# Altium schematic sheet SunS_Panels_Interfaces.SchDoc: Panel connectors
size A4; Author: Michał Gumiela
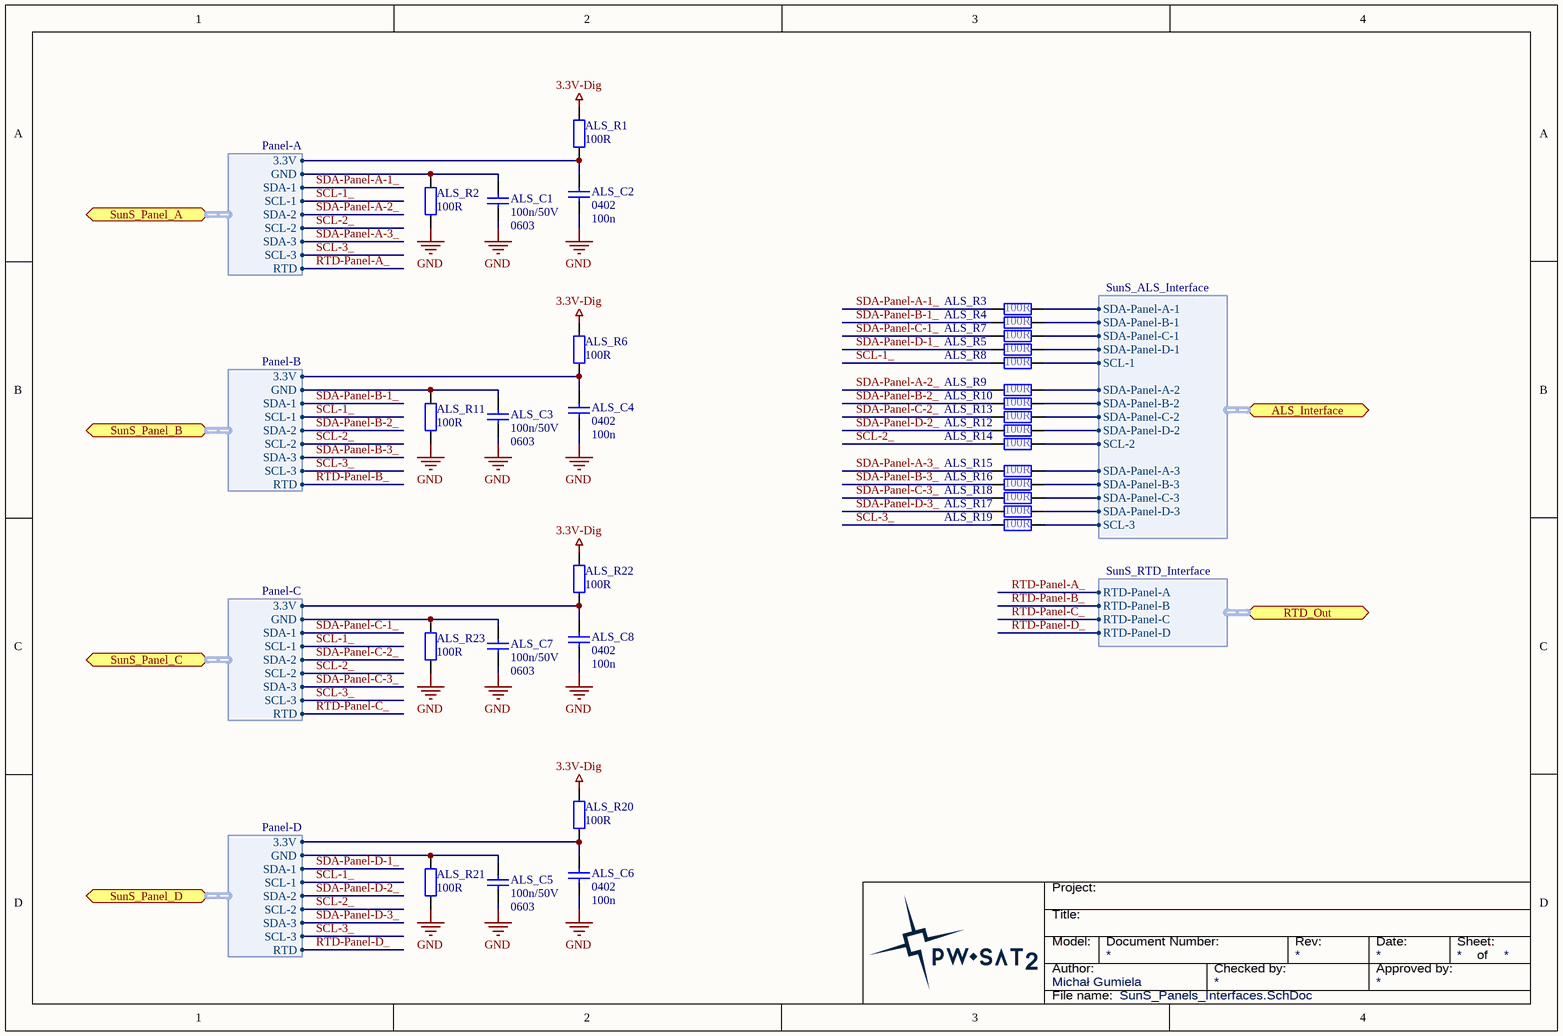
[diagram p0: SunS_Panels_Interfaces.SchDoc]

## Parts
ALS_C1  value 100n/50V  Package: 0603  [SMD_Capacitor_0603]  (hidden comment: Cap)
ALS_C2  0402  value 100n  [SMD_Capacitor_0402]
ALS_C3  value 100n/50V  Package: 0603  [SMD_Capacitor_0603]  (hidden comment: Cap)
ALS_C4  0402  value 100n  [SMD_Capacitor_0402]
ALS_C5  value 100n/50V  Package: 0603  [SMD_Capacitor_0603]  (hidden comment: Cap)
ALS_C6  0402  value 100n  [SMD_Capacitor_0402]
ALS_C7  value 100n/50V  Package: 0603  [SMD_Capacitor_0603]  (hidden comment: Cap)
ALS_C8  0402  value 100n  [SMD_Capacitor_0402]
ALS_R1  100R  [SMD_Resistor_0402]
ALS_R2  100R  [SMD_Resistor_0402]
ALS_R3  100R  [SMD_Resistor_0402]
ALS_R4  100R  [SMD_Resistor_0402]
ALS_R5  100R  [SMD_Resistor_0402]
ALS_R6  100R  [SMD_Resistor_0402]
ALS_R7  100R  [SMD_Resistor_0402]
ALS_R8  100R  [SMD_Resistor_0402]
ALS_R9  100R  [SMD_Resistor_0402]
ALS_R10  100R  [SMD_Resistor_0402]
ALS_R11  100R  [SMD_Resistor_0402]
ALS_R12  100R  [SMD_Resistor_0402]
ALS_R13  100R  [SMD_Resistor_0402]
ALS_R14  100R  [SMD_Resistor_0402]
ALS_R15  100R  [SMD_Resistor_0402]
ALS_R16  100R  [SMD_Resistor_0402]
ALS_R17  100R  [SMD_Resistor_0402]
ALS_R18  100R  [SMD_Resistor_0402]
ALS_R19  100R  [SMD_Resistor_0402]
ALS_R20  100R  [SMD_Resistor_0402]
ALS_R21  100R  [SMD_Resistor_0402]
ALS_R22  100R  [SMD_Resistor_0402]
ALS_R23  100R  [SMD_Resistor_0402]

## Ports
ALS_Interface (harness SunS_ALS_Interface), RTD_Out (harness SunS_RTD_Interface), SunS_Panel_A (harness Panel-A), SunS_Panel_B (harness Panel-B), SunS_Panel_C (harness Panel-C), SunS_Panel_D (harness Panel-D)

## Harnesses
SunS_ALS_Interface: SDA-Panel-A-1, SDA-Panel-D-1, SDA-Panel-B-1, SDA-Panel-C-1, SCL-1, SDA-Panel-A-2, SDA-Panel-D-2, SDA-Panel-B-2, SDA-Panel-C-2, SCL-2, SDA-Panel-A-3, SDA-Panel-D-3, SDA-Panel-B-3, SDA-Panel-C-3, SCL-3
SunS_RTD_Interface: RTD-Panel-A, RTD-Panel-B, RTD-Panel-C, RTD-Panel-D
Panel-B: 3.3V, GND, SDA-1, SCL-1, SDA-2, SCL-2, SDA-3, SCL-3, RTD
Panel-C: 3.3V, GND, SDA-1, SCL-1, SDA-2, SCL-2, SDA-3, SCL-3, RTD
Panel-D: 3.3V, GND, SDA-1, SCL-1, SDA-2, SCL-2, SDA-3, SCL-3, RTD
Panel-A: 3.3V, GND, SDA-1, SCL-1, SDA-2, SCL-2, SDA-3, SCL-3, RTD

## Nets
3.3V-Dig: ALS_R1.2 ALS_R6.2 ALS_R20.2 ALS_R22.2
GND: ALS_C1.2 ALS_C2.1 ALS_C3.2 ALS_C4.1 ALS_C5.2 ALS_C6.1 ALS_C7.2 ALS_C8.1 ALS_R2.1 ALS_R11.1 ALS_R21.1 ALS_R23.1
RTD-Panel-A_: port RTD_Out.RTD-Panel-A, port SunS_Panel_A.RTD
RTD-Panel-B_: port RTD_Out.RTD-Panel-B, port SunS_Panel_B.RTD
RTD-Panel-C_: port RTD_Out.RTD-Panel-C, port SunS_Panel_C.RTD
RTD-Panel-D_: port RTD_Out.RTD-Panel-D, port SunS_Panel_D.RTD
SCL-1_: ALS_R8.2 ; port SunS_Panel_B.SCL-1, port SunS_Panel_C.SCL-1, port SunS_Panel_D.SCL-1, port SunS_Panel_A.SCL-1
SCL-2_: ALS_R14.2 ; port SunS_Panel_B.SCL-2, port SunS_Panel_C.SCL-2, port SunS_Panel_D.SCL-2, port SunS_Panel_A.SCL-2
SCL-3_: ALS_R19.2 ; port SunS_Panel_B.SCL-3, port SunS_Panel_C.SCL-3, port SunS_Panel_D.SCL-3, port SunS_Panel_A.SCL-3
SDA-Panel-A-1_: ALS_R3.2 ; port SunS_Panel_A.SDA-1
SDA-Panel-A-2_: ALS_R9.2 ; port SunS_Panel_A.SDA-2
SDA-Panel-A-3_: ALS_R15.2 ; port SunS_Panel_A.SDA-3
SDA-Panel-B-1_: ALS_R4.2 ; port SunS_Panel_B.SDA-1
SDA-Panel-B-2_: ALS_R10.2 ; port SunS_Panel_B.SDA-2
SDA-Panel-B-3_: ALS_R16.2 ; port SunS_Panel_B.SDA-3
SDA-Panel-C-1_: ALS_R7.2 ; port SunS_Panel_C.SDA-1
SDA-Panel-C-2_: ALS_R13.2 ; port SunS_Panel_C.SDA-2
SDA-Panel-C-3_: ALS_R18.2 ; port SunS_Panel_C.SDA-3
SDA-Panel-D-1_: ALS_R5.2 ; port SunS_Panel_D.SDA-1
SDA-Panel-D-2_: ALS_R12.2 ; port SunS_Panel_D.SDA-2
SDA-Panel-D-3_: ALS_R17.2 ; port SunS_Panel_D.SDA-3
NetALS_C1_1: ALS_C1.1 ALS_R2.2 ; port SunS_Panel_A.GND
NetALS_C2_2: ALS_C2.2 ALS_R1.1 ; port SunS_Panel_A.3.3V
NetALS_C3_1: ALS_C3.1 ALS_R11.2 ; port SunS_Panel_B.GND
NetALS_C4_2: ALS_C4.2 ALS_R6.1 ; port SunS_Panel_B.3.3V
NetALS_C5_1: ALS_C5.1 ALS_R21.2 ; port SunS_Panel_D.GND
NetALS_C6_2: ALS_C6.2 ALS_R20.1 ; port SunS_Panel_D.3.3V
NetALS_C7_1: ALS_C7.1 ALS_R23.2 ; port SunS_Panel_C.GND
NetALS_C8_2: ALS_C8.2 ALS_R22.1 ; port SunS_Panel_C.3.3V
NetALS_R3_1: ALS_R3.1 ; port ALS_Interface.SDA-Panel-A-1
NetALS_R4_1: ALS_R4.1 ; port ALS_Interface.SDA-Panel-B-1
NetALS_R5_1: ALS_R5.1 ; port ALS_Interface.SDA-Panel-D-1
NetALS_R7_1: ALS_R7.1 ; port ALS_Interface.SDA-Panel-C-1
NetALS_R8_1: ALS_R8.1 ; port ALS_Interface.SCL-1
NetALS_R9_1: ALS_R9.1 ; port ALS_Interface.SDA-Panel-A-2
NetALS_R10_1: ALS_R10.1 ; port ALS_Interface.SDA-Panel-B-2
NetALS_R12_1: ALS_R12.1 ; port ALS_Interface.SDA-Panel-D-2
NetALS_R13_1: ALS_R13.1 ; port ALS_Interface.SDA-Panel-C-2
NetALS_R14_1: ALS_R14.1 ; port ALS_Interface.SCL-2
NetALS_R15_1: ALS_R15.1 ; port ALS_Interface.SDA-Panel-A-3
NetALS_R16_1: ALS_R16.1 ; port ALS_Interface.SDA-Panel-B-3
NetALS_R17_1: ALS_R17.1 ; port ALS_Interface.SDA-Panel-D-3
NetALS_R18_1: ALS_R18.1 ; port ALS_Interface.SDA-Panel-C-3
NetALS_R19_1: ALS_R19.1 ; port ALS_Interface.SCL-3

## Notes on the sheet
- Title:
- Project:
- Author:
- Model:
- Document Number:
- Checked by:
- Rev:
- Date:
- Approved by:
- Sheet:
- of
- File name:

## Library data of the parts
ALS_C2 ALS_C4 ALS_C6 ALS_C8 = Cap: Capacitor; Published: 8-Jun-2000; LatestRevisionDate: 17-Jul-2002; LatestRevisionNote: Re-released for DXP Platform.; PackageReference: RAD-0.3; Publisher: Altium Limited; PackageDescription: Radial Cap, Thru-Hole; 2 Leads; 0.3 in Pin Spacing
ALS_R1-ALS_R23 = CRCW040210R0FKxxxx: 10R/1% Vishay CRCW 0402 Resistor. 63mW, 100ppm, 50V.; Manufacturer: Vishay; ManufacturerPartNumber: CRCW040210R0FKxxxx; Value: 100R; Package: 0402